# Altium schematic sheet v009 schematics.SCHDOC
size C
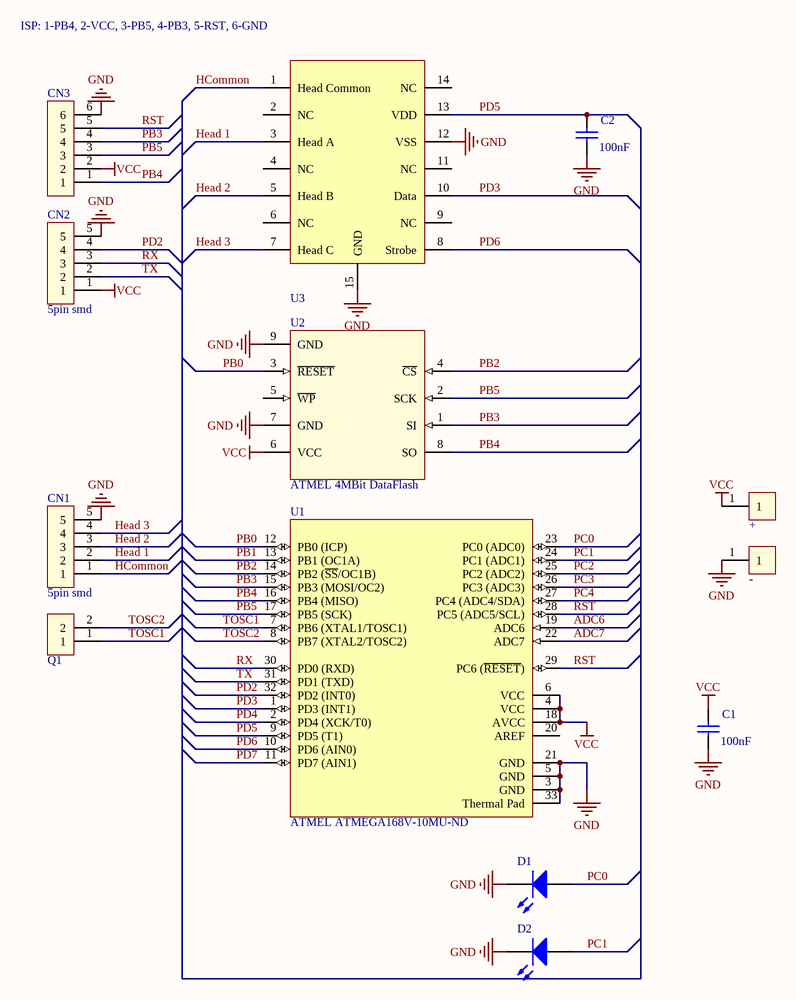
[diagram p0: v009 schematics.SCHDOC]

## Parts
+  No component mounted  [SU01LS]  (value not drawn)
-  No component mounted  [SU01LS]  (value not drawn)
C1  100nF  [CC0603(0201)]
C2  100nF  [CC0603(0201)]
CN1  5pin smd  [SU05LSR wide]
CN2  5pin smd  [SU05LSR wide]
CN3  No component mounted  [SU06LST FULL]  (value not drawn)
D1  LED1  [CC1005(0402)]  (value not drawn)
D2  LED1  [CC1005(0402)]  (value not drawn)
Q1  32.768khz crystal 1.5 x 3.2mm  [Quartz SMD (small)]  (value not drawn)
U1  ATMEL ATMEGA168V-10MU-ND  [32M1-A L 3]
U2  ATMEL 4MBit DataFlash  [8m1-a mlf 3]
U3  Asic 3V MLF14  [delta asic - 5]  (value not drawn)

## Nets
GND: -.1 C1.2 C2.2 CN1.5 CN2.5 CN3.6 D1.2(K) D2.2(K) U1.3(GND) U1.5(GND) U1.21(GND) U1.33(Thermal_Pad) U2.7(GND) U2.9(GND) U3.12(VSS) U3.15(GND)
VCC: +.1 C1.1 CN2.1 CN3.2 U1.4(VCC) U1.6(VCC) U1.18(AVCC) U2.6(VCC)
ADC6: U1.19(ADC6)
ADC7: U1.22(ADC7)
HCommon: CN1.1 U3.1(Head_Common)
Head 1: CN1.2 U3.3(Head_A)
Head 2: CN1.3 U3.5(Head_B)
Head 3: CN1.4 U3.7(Head_C)
PB0: U1.12(PB0_(ICP)) U2.3(~{RESET})
PB1: U1.13(PB1_(OC1A))
PB2: U1.14(PB2_(~{SS}/OC1B)) U2.4(~{CS})
PB3: CN3.4 U1.15(PB3_(MOSI/OC2)) U2.1(SI)
PB4: CN3.1 U1.16(PB4_(MISO)) U2.8(SO)
PB5: CN3.3 U1.17(PB5_(SCK)) U2.2(SCK)
PC0: D1.1(A) U1.23(PC0_(ADC0))
PC1: D2.1(A) U1.24(PC1_(ADC1))
PC2: U1.25(PC2_(ADC2))
PC3: U1.26(PC3_(ADC3))
PC4: U1.27(PC4_(ADC4/SDA))
PD2: CN2.4 U1.32(PD2_(INT0))
PD3: U1.1(PD3_(INT1)) U3.10(Data)
PD4: U1.2(PD4_(XCK/T0))
PD5: C2.1 U1.9(PD5_(T1)) U3.13(VDD)
PD6: U1.10(PD6_(AIN0)) U3.8(Strobe)
PD7: U1.11(PD7_(AIN1))
RST: CN3.5 U1.28(PC5_(ADC5/SCL)) U1.29(PC6_(~{RESET}))
RX: CN2.3 U1.30(PD0_(RXD))
TOSC1: Q1.1 U1.7(PB6_(XTAL1/TOSC1))
TOSC2: Q1.2 U1.8(PB7_(XTAL2/TOSC2))
TX: CN2.2 U1.31(PD1_(TXD))

Not connected (* = marked no-connect by the designer): U1 20(AREF); U2 5(~{WP}); U3 2(NC) 4(NC) 6(NC) 9(NC) 11(NC) 14(NC)

## Notes on the sheet
- ISP: 1-PB4, 2-VCC, 3-PB5, 4-PB3, 5-RST, 6-GND

## Library data of the parts
+ - = 1pin smd
C1 = Cap: 100nf Capacitor - Footprint CC0603 (0201); Manufacturer: Murata Electronics; Manufacturer Description: CAP CER .1UF 6.3V X5R 0201; Manufacturer Part Number: GRM033R60J104KE19D; Published: 8-Jun-2000; Revision: July-2002: Re-released for DXP Platform.; Publisher: Altium Limited; Value: 100nF; Digi-Key Part Number: 490-3167-1-ND
C2 = Cap: 100nf Capacitor - Footprint CC0603 (0201); Manufacturer: Murata Electronics; Manufacturer Part Number: GRM033R60J104KE19D; Description: CAP CER .1UF 6.3V X5R 0201; Published: 8-Jun-2000; Revision: July-2002: Re-released for DXP Platform.; Publisher: Altium Limited; Value: 100nF; Digi-Key Part Number: 490-3167-1-ND; Manufacturer Description: CAP CER .1UF 6.3V X5R 0201
CN1 CN2 = 5pin smd: No component mounted
  CN1: Digi-Key Part Number: *; Manufacturer: *; Manufacturer Description: *; Manufacturer Part Number: *
CN3 = 6pin smd: Digi-Key Part Number: *; Manufacturer: *; Manufacturer Description: *; Manufacturer Part Number: *
D1 = LED3: LED 0402 GREEN 465NM TRANSPARENT; Manufacturer: Rohm Semiconductor; Manufacturer Description: LED 0402 BLUE 465NM TRANSPARENT; Manufacturer Part Number: SMLP12BC7TT86; Revision 1: Jul-2002: Re-released for DXP Platform.; Revision 2: 17-Dec-2003: PCB Footprint replaced.; Published: 8-Jun-2000; Publisher: Altium Limited; Digi-Key Part Number: 511-1615-1-ND
D2 = LED3: LED 0402 RED 465NM TRANSPARENT; Manufacturer: Rohm Semiconductor; Manufacturer Description: LED 0402 BLUE 465NM TRANSPARENT; Manufacturer Part Number: SMLP12BC7TT86; Revision 1: Jul-2002: Re-released for DXP Platform.; Revision 2: 17-Dec-2003: PCB Footprint replaced.; Published: 8-Jun-2000; Publisher: Altium Limited; Digi-Key Part Number: 511-1615-1-ND
Q1 = 2pin smd: CRYSTAL 32.768KHZ 1.5 x 3.2mm; Manufacturer: Abracon Corporation; Manufacturer Description: CRYSTAL 32.768KHZ 12.5PF SMD; Manufacturer Part Number: ABS07-32.768KHZ-T; Digi-Key Part Number: 535-9542-1-ND
U1 = ATmega8L-8MC: ATMEL ATMEGA168V-10MU; Manufacturer Description: IC AVR MCU 16K 10MHZ 32-QFN 8-Bit AVR Microcontroller; Published: 26-May-2004; LatestRevisionDate: 13-Apr-2006; LatestRevisionNote: IPC-7351 Footprint Added.; DatasheetVersion: 2486H-AVR-09/02; PackageVersion: revB, Aug-2001; PackageReference: 32M1-A; Publisher: Altium Limited; PackageDescription: 32-Pin Quad Flat No-Lead 0.5 mm Pitch; Code_JEDEC: MO-220-VHHD-2; ComponentLink1Description: Manufacturer Link; ComponentLink1URL: http://www.atmel.com; ComponentLink2Description: Datasheet; ComponentLink2URL: http://www.atmel.com/dyn/resources/prod_documents/doc2486.pdf; Digi-Key Part Number: ATMEGA168V-10MU-ND; Manufacturer: ATMEL; Manufacturer Part Number: ATMEGA168V-10MU
U2 = at45db041b
U3 = delta asic 3volt: Manufacturer: Magtek; Manufacturer part number: 21006540; Manufacturer description: Delta Asic Triple Track, F/2F Decode, 3V MLF14; Digi-Key Part Number: *